# Altium schematic sheet [01]-POWER.SchDoc
size A4; SheetNumber: 1; SheetTotal: 4
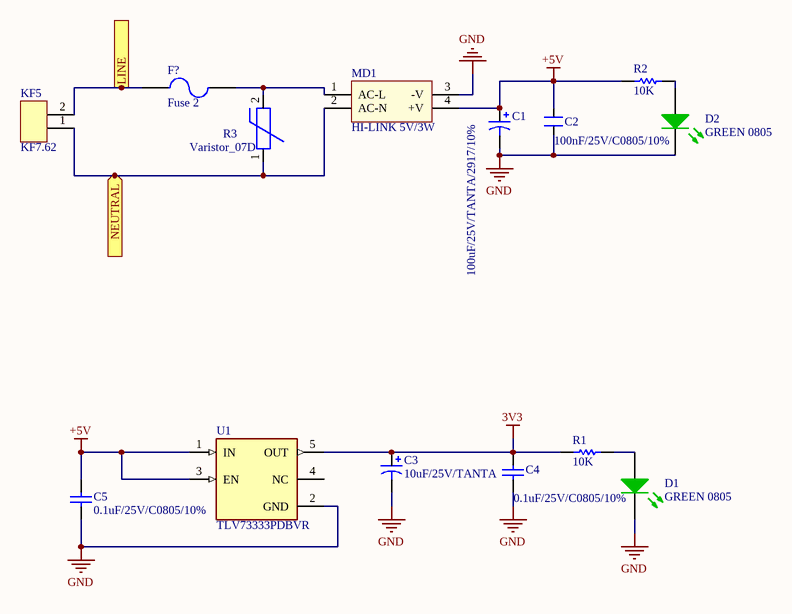
[diagram p0: [01]-POWER.SchDoc]

## Parts
C1  100uF/25V/TANTA/2917/10%  [CAP TANT CASE X SMD]
C2  100nF/25V/C0805/10%  [CAP_CERA_C2012(CC0805INCH)]
C3  10uF/25V/TANTA  [CAP TANT CASE B SMD]
C4  0.1uF/25V/C0805/10%  [CAP_CERA_C2012(CC0805INCH)]
C5  0.1uF/25V/C0805/10%  [CAP_CERA_C2012(CC0805INCH)]
D1  GREEN 0805  [Led 0805G]
D2  GREEN 0805  [Led 0805G]
F?  Fuse 2  [FUSE-BLX-A 5x20MM]
KF5  KF7.62  [KF-7.62]
MD1  HI-LINK 5V/3W  [HILINK 5V/3W]
R1  10K  [Res 0603 SMD]
R2  10K  [Res 0603 SMD]
R3  Varistor_07D  [Varistor_07D]
U1  TLV73333PDBVR  [SOT95P280X145-5N]

## Ports
LINE (in, see [04]-OUTPUT[2A], [04]-OUTPUT[2C], [04]-OUTPUT[4A], [04]-OUTPUT[4C]), NEUTRAL (in, see [04]-OUTPUT[2A], [04]-OUTPUT[2C], [04]-OUTPUT[4A], [04]-OUTPUT[4C])

## Nets
3V3: C3.1 C4.1 R1.1 U1.5(OUT)
+5V: C1.1 C2.2 C5.1 MD1.4(+V) R2.1 U1.1(IN) U1.3(EN)
GND: C1.2 C2.1 C3.2 C4.2 C5.2 D1.2(K) D2.2(K) MD1.3(-V) U1.2(GND)
LINE: F?.1 KF5.2 ; port LINE
NEUTRAL: KF5.1 MD1.2(AC-N) R3.1 ; port NEUTRAL
NetD1_1: D1.1(A) R1.2
NetD2_1: D2.1(A) R2.2
NetF?_2: F?.2 MD1.1(AC-L) R3.2

Not connected (* = marked no-connect by the designer): U1 4(NC)

## Notes on the sheet
- Title
- Size:
- Date:
- Author:
- A4
- Time:
- Number:
- Checked:
- Revision:
- Sheet
- Approved:
- of
- File:

## Library data of the parts
C1 = 100uF/6.3V/SIZE B/20%: CAP TANT 100UF 6.3V 20% 1411; Manufacturer: Kemet; Manufacturer Part Number: T491B107M006AT; Manufacturer Size Code: B; Capacitance: 100µF; ESR (Equivalent Series Resistance): 3 Ohm; Type: Molded; Lifetime @ Temp.: 2000 Hrs @ 85°C; RoHS: RoHS Compliant; Category: Capacitors; Packaging: Cut Tape (CT); Tolerance: ±20%; Voltage - Rated: 6.3V; Operating Temperature: -55°C ~ 125°C; Mounting Type: Surface Mount; Package / Case: 1411 (3528 Metric); Size / Dimension: 0.138" L x 0.110" W (3.50mm x 2.80mm); Height - Seated (Max): 0.083" (2.10mm); Lead Spacing: -; Features: General Purpose; ComponentLink1URL: http://www.kemet.com/Lists/ProductCatalog/Attachments/254/KEM_T2005_T491.pdf; ComponentLink1Description: http://www.kemet.com/Lists/ProductCatalog/Attachments/254/KEM_T2005_T491.pdf; Supplier 1: Digi-Key; Supplier Part Number 1: 399-3710-1-ND
C2 = CAP CERA 0805: CERAMIC CAP 0805; Value: 100pF, 2012
C3 = TAJB106M025RNJ: 10µF Molded Tantalum Capacitors 25V 1411 (3528 Metric) 3 Ohm; Manufacturer: KEMET; Digikey: 399-5125-1-ND
C4 C5 = 0.1uF/50V/C0603/10%_5: 0.1µF ±10% 25V Ceramic Capacitor X7R 0805 (2012 Metric); ComponentLink1URL: http://www.murata.com/~/media/webrenewal/support/library/catalog/products/capacitor/mlcc/c02e.ashx; ComponentLink1Description: http://www.murata.com/~/media/webrenewal/support/library/catalog/products/capacitor/mlcc/c02e.ashx; Digikey: 478-3755-1-ND
D1 D2 = LED GREEN 0603: Green 571nm LED Indication - Discrete 2V 0805 (2012 Metric); ComponentLink1URL: http://optoelectronics.liteon.com/upload/download/DS22-2000-074/S_110_LTST-C190KGKT.pdf; ComponentLink1Description: http://optoelectronics.liteon.com/upload/download/DS22-2000-074/S_110_LTST-C190KGKT.pdf; Digikey: 160-1426-1-ND
F? = Fuse 2: Fuse; Published: 8-Jun-2000; LatestRevisionDate: 17-Jul-2002; LatestRevisionNote: Re-released for DXP Platform.; PackageReference: PIN-W2/E2.8; Publisher: Altium Limited
KF5 = KF 2P
R1 R2 = 15K/R0603/1%_3: RES SMD 10K OHM 1% 1/10W 0603; Manufacturer: Yageo; Manufacturer Part Number: RC0603FR-0715KL; Resistance (Ohms): 15k; Power (Watts): 0.1W, 1/10W; Temperature Coefficient: ±100ppm/°C; RoHS: RoHS Compliant; Category: Resistors; Packaging: Digi-Reel®; Tolerance: ±1%; Composition: Thick Film; Features: Moisture Resistant; Operating Temperature: -55°C ~ 155°C; Package / Case: 0603 (1608 Metric); Supplier Device Package: 0603; Size / Dimension: 0.063" L x 0.031" W (1.60mm x 0.80mm); Height: 0.022" (0.55mm); Number of Terminations: 2; ComponentLink1URL: http://www.yageo.com/NewPortal/yageodocoutput?fileName=/pdf/R-Chip/PYu-RC_Group_51_RoHS_L_3.pdf; ComponentLink1Description: http://www.yageo.com/NewPortal/yageodocoutput?fileName=/pdf/R-Chip/PYu-RC_Group_51_RoHS_L_3.pdf; Supplier 1: Digi-Key; Supplier Part Number 1: 311-15.0KHRCT-ND
U1 = TLV73333PDBVR: 300-mA, capacitor-free, low-IQ, low-dropout voltage regulator with enable; MF: Texas Instruments; SnapEDA_Link: https://www.snapeda.com/parts/TLV73333PDBVR/Texas+Instruments/view-part/?ref=snap; Package: SOT-23-5 Texas Instruments; Value: *; MP: TLV73333PDBVR; Check_prices: https://www.snapeda.com/parts/TLV73333PDBVR/Texas+Instruments/view-part/?ref=eda